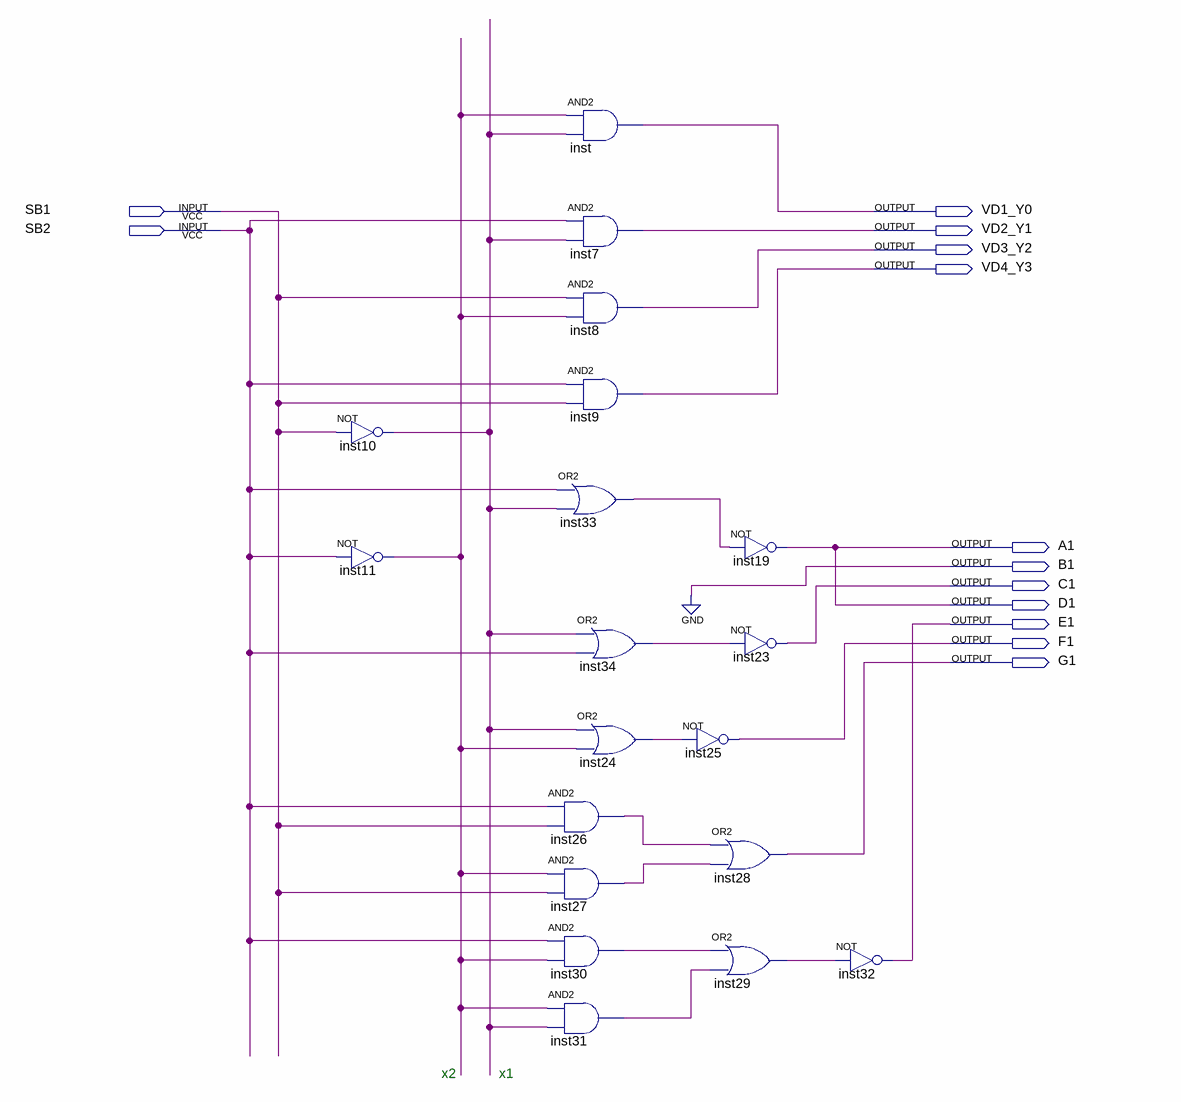
[diagram p0: schematic sheet]
// Quartus schematic Block2.bdf as structural Verilog: 19 symbols, 13 pins
module Block2 (
  input  SB1,
  input  SB2,
  output VD1_Y0,
  output VD2_Y1,
  output VD3_Y2,
  output VD4_Y3,
  output A1,
  output B1,
  output C1,
  output D1,
  output E1,
  output F1,
  output G1
);

  wire inst10_out, inst11_out, inst24_out, inst26_out, inst27_out, inst29_out, inst30_out, inst31_out,
       inst33_out, inst34_out;

  not inst10 (inst10_out, SB1);
  not inst11 (inst11_out, SB2);
  and inst (VD1_Y0, inst11_out, inst10_out);
  and inst7 (VD2_Y1, SB2, inst10_out);
  and inst8 (VD3_Y2, SB1, inst11_out);
  and inst9 (VD4_Y3, SB2, SB1);
  or inst33 (inst33_out, SB2, inst10_out);
  or inst34 (inst34_out, inst10_out, SB2);
  or inst24 (inst24_out, inst10_out, inst11_out);
  and inst26 (inst26_out, SB2, SB1);
  and inst27 (inst27_out, inst11_out, SB1);
  and inst30 (inst30_out, SB2, inst11_out);
  and inst31 (inst31_out, inst11_out, inst10_out);
  not inst19 (A1, inst33_out);
  not inst23 (C1, inst34_out);
  not inst25 (F1, inst24_out);
  or inst28 (G1, inst26_out, inst27_out);
  or inst29 (inst29_out, inst30_out, inst31_out);
  not inst32 (E1, inst29_out);

  assign B1 = 1'b0;
  assign D1 = A1;

  // Notes on the sheet:
  //   x2
  //   x1
endmodule
